# Altium schematic sheet esc_connector.SchDoc: ESC Connector
size A4; DrawnBy: Juan I Carrano
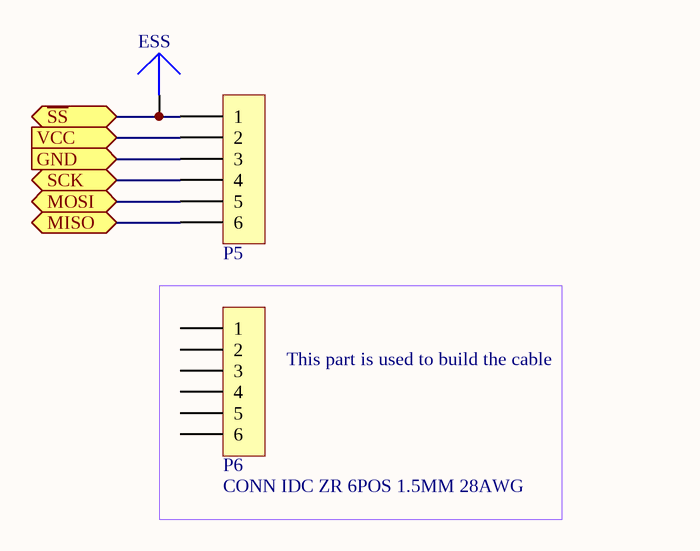
[diagram p0: esc_connector.SchDoc]

## Parts
ESS  TESTPOINT-ARROW-BLUE  [G-PIN_1mm-CIRCLE]  (value not drawn)
P5  HEADER-6x1  [X-JST-S6B-ZR]  (value not drawn)
P6  HEADER-6x1_Mech  (value not drawn)  (mechanical)

## Blocks framed on the sheet
This part is used to build the cable: P6

## Ports
GND (in), MISO, MOSI, SCK, VCC (in), ~{SS}

## Nets
GND: P5.3 ; port GND
MISO: P5.6 ; port MISO
MOSI: P5.5 ; port MOSI
~{SS}: ESS.1 P5.1 ; port ~{SS}
SCK: P5.4 ; port SCK
VCC: P5.2 ; port VCC

Not connected (* = marked no-connect by the designer): P6 1 2 3 4 5 6

## Notes on the sheet
- Title
- Size:
- Date:
- A4
- Number:
- Time:
- Revision:
- Sheet
- of
- File:
- Drawn by:

## Library data of the parts
ESS = TESTP_SIG_1mm: Tespoint; Name: TESTP_SIG_1mm
P5 = HEADER_6x1_1.5mm_ZH_TH: CONN HEADER ZH SIDE 6POS 1.5MM; Manufacturer: JST Sales America Inc; Manufacturer Part Number: S6B-ZR(LF)(SN); Name: HEADER_6x1_1.5mm_ZH_TH; Supplier 1: Digi-Key; Supplier Part Number 1: 455-1673-ND
P6 = HEADER_6x1_1.5mm_ZH_TH_Wire: CONN IDC ZR 6POS 1.5MM 28AWG; Manufacturer: JST Sales America Inc; Manufacturer Part Number: 06ZR-8M-P; Name: HEADER_6x1_1.5mm_ZH_TH_Wire; Supplier 1: Digi-Key; Supplier Part Number 1: 455-2293-ND